# Altium schematic sheet MEHCP.SchDoc
size A4; SheetNumber: 3; SheetTotal: 6
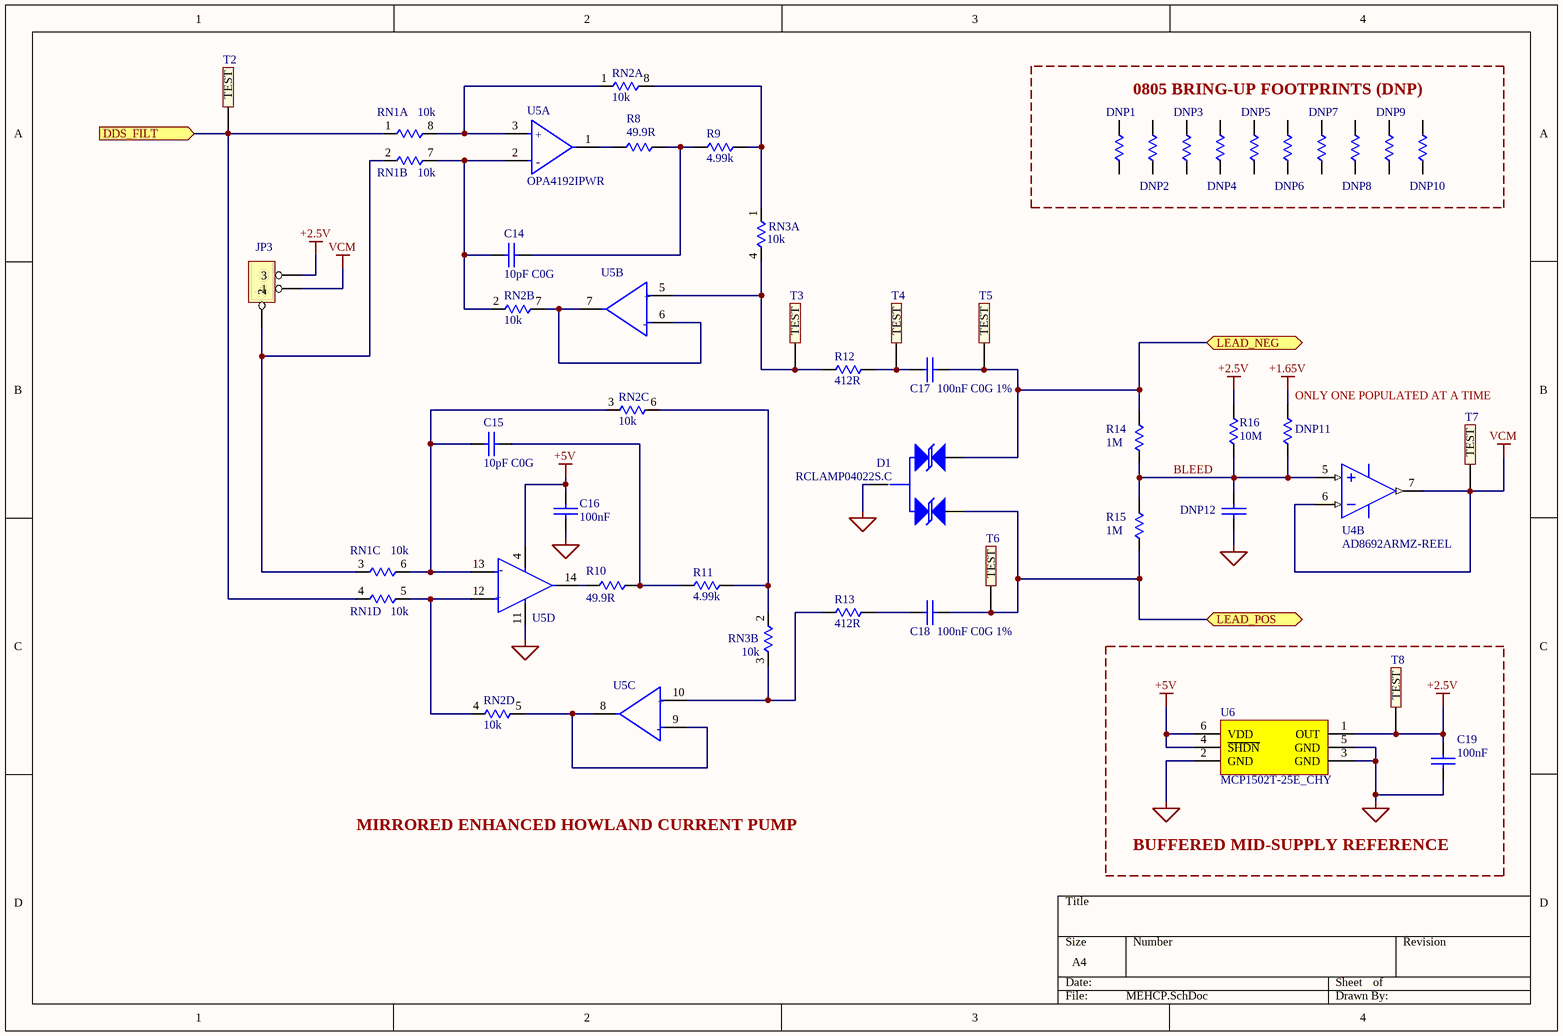
[diagram p0: MEHCP.SchDoc]

## Parts
C14  10pF C0G  [0603-CAP]
C15  10pF C0G  [0603-CAP]
C16  100nF  [0603-CAP]
C17  100nF C0G 1%  [1206-CAP]
C18  100nF C0G 1%  [1206-CAP]
C19  100nF  [0603-CAP]
D1  RCLAMP04022S.C  [SOT-23 3L]
DNP1  240R 0.1%  [0805-RES]  (value not drawn)  (no BOM)
DNP2  240R 0.1%  [0805-RES]  (value not drawn)  (no BOM)
DNP3  240R 0.1%  [0805-RES]  (value not drawn)  (no BOM)
DNP4  240R 0.1%  [0805-RES]  (value not drawn)  (no BOM)
DNP5  240R 0.1%  [0805-RES]  (value not drawn)  (no BOM)
DNP6  240R 0.1%  [0805-RES]  (value not drawn)  (no BOM)
DNP7  240R 0.1%  [0805-RES]  (value not drawn)  (no BOM)
DNP8  240R 0.1%  [0805-RES]  (value not drawn)  (no BOM)
DNP9  240R 0.1%  [0805-RES]  (value not drawn)  (no BOM)
DNP10  240R 0.1%  [0805-RES]  (value not drawn)  (no BOM)
DNP11  10M  [0603-RES]  (value not drawn)  (no BOM)
DNP12  4.7nF C0G  [0603-CAP]  (value not drawn)  (no BOM)
JP3  JUMPER1X3  [JUMPER3]  (value not drawn)
R8  49.9R  [0603-RES]
R9  4.99k  [0603-RES]
R10  49.9R  [0603-RES]
R11  4.99k  [0603-RES]
R12  412R  [0603-RES]
R13  412R  [0603-RES]
R14  1M  [0603-RES]
R15  1M  [0603-RES]
R16  10M  [0603-RES]
RN1  10k  [1206 4-Resistor Network]  (parts A,B,C,D of 4)
RN2  10k  [1206 4-Resistor Network]  (parts A,B,C,D of 4)
RN3  10k  [0606 2-RESISTOR NETWORK]  (parts A,B of 2)
T2  5002K  [TESTPOINT White]  (value not drawn)
T3  5002K  [TESTPOINT White]  (value not drawn)
T4  5002K  [TESTPOINT White]  (value not drawn)
T5  5002K  [TESTPOINT White]  (value not drawn)
T6  5002K  [TESTPOINT White]  (value not drawn)
T7  5002K  [TESTPOINT White]  (value not drawn)
T8  5002K  [TESTPOINT White]  (value not drawn)
U4  AD8692ARMZ-REEL  [ADI-RM-8_M]  (part B of 2)
U5  OPA4192IPWR  [FP-PW0014A-IPC_C]  (parts A,B,C,D of 4)
U6  MCP1502T-25E_CHY  [SOT95P280X145-6N]

## Blocks framed on the sheet
0805 BRING-UP FOOTPRINTS (DNP): DNP1-DNP10
BUFFERED MID-SUPPLY REFERENCE: C19 T8 U6

## Ports
DDS_FILT (in, see BLOCK DIAGRAM[3B], MCU[3C]), LEAD_NEG (bidir, see BLOCK DIAGRAM[3B], LOADS[1A]), LEAD_POS (bidir, see BLOCK DIAGRAM[3B], LOADS[1A])

## Nets
+1.65V: DNP11.2
+2.5V: C19.1 JP3.3 R16.2 T8.1(TEST) U6.1(OUT)
+5V: C16.1 U5.4(V+) U6.4(~{SHDN}) U6.6(VDD)
GND: C16.2 C19.2 D1.3 DNP12.1 U5.11(V-) U6.2(GND) U6.3(GND) U6.5(GND)
VCM: JP3.1 T7.1(TEST) U4.6(-IN_B) U4.7(OUT_B)
BLEED: DNP11.1 DNP12.2 R14.1 R15.2 R16.1 U4.5(+IN_B)
DDS_FILT: RN1.1 RN1.4 T2.1(TEST) ; port DDS_FILT
LEAD_NEG: C17.2 D1.2 R14.2 T5.1(TEST) ; port LEAD_NEG
LEAD_POS: C18.2 D1.1 R15.1 T6.1(TEST) ; port LEAD_POS
NetC14_1: C14.1 RN1.7 RN2.2 U5.2(-IN_A)
NetC14_2: C14.2 R8.2 R9.1
NetC15_1: C15.1 RN1.6 RN2.3 U5.13(-IN_D)
NetC15_2: C15.2 R10.2 R11.1
NetC17_1: C17.1 R12.2 T4.1(TEST)
NetC18_1: C18.1 R13.2
NetJP3_2: JP3.2 RN1.2 RN1.3
NetR8_1: R8.1 U5.1(OUT_A)
NetR9_2: R9.2 RN2.8 RN3.1
NetR10_1: R10.1 U5.14(OUT_D)
NetR11_2: R11.2 RN2.6 RN3.2
NetR12_1: R12.1 RN3.4 T3.1(TEST) U5.5(+IN_B)
NetR13_1: R13.1 RN3.3 U5.10(+IN_C)
NetRN1_5: RN1.5 RN2.4 U5.12(+IN_D)
NetRN1_8: RN1.8 RN2.1 U5.3(+IN_A)
NetRN2_5: RN2.5 U5.8(OUT_C) U5.9(-IN_C)
NetRN2_7: RN2.7 U5.6(-IN_A) U5.7(OUT_B)

Not connected (* = marked no-connect by the designer): DNP1 1 2; DNP2 1 2; DNP3 1 2; DNP4 1 2; DNP5 1 2; DNP6 1 2; DNP7 1 2; DNP8 1 2; DNP9 1 2; DNP10 1 2

## Notes on the sheet
- (near DNP11) ONLY ONE POPULATED AT A TIME
- MIRRORED ENHANCED HOWLAND CURRENT PUMP
- (in symbol CMP-04895-000439-1, part A) +; -
- (in symbol CMP-04895-000439-1, part B) +; -
- (in symbol CMP-04895-000439-1, part C) +; -
- (in symbol CMP-04895-000439-1, part D) -; +

## Library data of the parts
C14 C15 = CGA3E2C0G1H472J080AA: CAP CER 10PF 50V C0G 0603; Manufacturer Part Number 1: CC0603JRNPO9BN100; Manufacturer 1: Murata; Tech#: SMT; Detailed Description: CAP CER 10PF 50V C0G 0603; Supplier 1: DigiKey; Supplier Part Number 1: 311-1058-1-ND; Supplier 2: Mouser; Supplier Part Number 2: 810-CGA3E2C0G1H472J; Price(100): 0.1434; Price(250): 0.10756
C16 C19 = CGA3E2C0G1H472J080AA: CAP CER 100 NF 50V X7R 0603; Manufacturer Part Number 1: CC0603KRX7R9BB104; Manufacturer 1: YAGEO; Tech#: SMT; Detailed Description: CAP CER 100 NF 50V X7R 0603; Supplier 1: DigiKey; Supplier Part Number 1: 311-1344-1-ND; Supplier 2: Mouser; Supplier Part Number 2: 810-CGA3E2C0G1H472J; Price(100): 0.1434; Price(250): 0.10756
C17 C18 = GRM31C5C1H104JA01L: CAP CER 0.1UF 1% 50V C0G/NP0 1206; Manufacturer Part Number 1: GRT31C5C1H104FA02L; Manufacturer 1: Murata; Tech#: SMT; Detailed Description: CAP CER 0.1UF 1% 50V C0G/NP0 1206; Supplier 1: DigiKey; Supplier Part Number 1: 490-GRT31C5C1H104FA02LCT-ND; Supplier 2: Mouser; Supplier Part Number 2: 81-GRM31C5C1H104JA1L; Price(100): 0.2317
DNP1-DNP10 = 240R 0.1%: RES SMD 240 OHM 0.1% 1/8W 0805; Manufacturer Part Number 1: RG2012P-241-B-T5; Manufacturer 1: Susumu; Tech#: SMT; Detailed Description: RES SMD 240 OHM 0.1% 1/8W 0805; Supplier 1: Mouser; Supplier Part Number 1: 754-RG2012P-241-BT5; Supplier 2: DigiKey; Supplier Part Number 2: RG20P240BCT-ND; Price(100): 0.149
DNP11 R16 = 4.99K 0603: RES SMD 10MOHM 1% 1/10W 0603; Manufacturer Part Number 1: RC0603FR-0710ML; Manufacturer 1: YAGEO; Tech#: SMT; Detailed Description: RES SMD 10MOHM 1% 1/10W 0603; Supplier 1: DigiKey; Supplier Part Number 1: 311-10.0MHRCT-ND; Supplier 2: Mouser; Supplier Part Number 2: 754-RR0816P-4991D68H; Price(100): 0.023
DNP12 = CGA3E2C0G1H472J080AA: CAP CER 4700PF 50V C0G 0603; Manufacturer Part Number 1: GRM1885C1H472JA01D; Manufacturer 1: Murata; Tech#: SMT; Detailed Description: CAP CER 4700PF 50V C0G 0603; Supplier 1: DigiKey; Supplier Part Number 1: 490-9669-1-ND; Supplier 2: Mouser; Supplier Part Number 2: 810-CGA3E2C0G1H472J; Price(100): 0.1434; Price(250): 0.10756
JP3 = 68001-203HLF: CONN HEADER VERT 36POS 2.54MM; Manufacturer 1: FCI; Detailed Description: Jumper, 1x3 Vertical T/H 0.1in; Location: #N/A; Notes: Can be 68001-236HLF cut to length; Tech#: T/H; Manufacturer Part Number 1: 68001-203HLF; Supplier 1: DigiKey; Supplier Part Number 1: 609-3470-ND; Supplier 2: Mouser; Supplier Part Number 2: 649-68001-203HLF; Price(1): 0.43; Price(10): 0.32; Price(25): 0.32; Price(100): 0.2436
R8 R10 = 4.99K 0603: RES SMD 49.9OHM 0.1% 1/10W 0603; Manufacturer Part Number 1: RT0603BRD0749R9L; Manufacturer 1: Yageo; Tech#: SMT; Detailed Description: RES SMD 49.9OHM 0.1% 1/10W 0603; Supplier 1: DigiKey; Supplier Part Number 1: YAG1672CT-ND; Supplier 2: Mouser; Supplier Part Number 2: 754-RR0816P-4991D68H; Price(100): 0.023
R9 R11 = 4.99K 0603: RES SMD 4.99KOHM 0.1% 1/10W 0603; Manufacturer Part Number 1: RG1608P-4991-B-T5; Manufacturer 1: Susumu; Tech#: SMT; Detailed Description: RES SMD 4.99KOHM 0.1% 1/10W 0603; Supplier 1: DigiKey; Supplier Part Number 1: RG16P4.99KBCT-ND; Supplier 2: Mouser; Supplier Part Number 2: 754-RR0816P-4991D68H; Price(100): 0.023
R12 R13 = 4.99K 0603: RES SMD 412OHM 0.1% 1/10W 0603; Manufacturer Part Number 1: RT0603BRD07412RL; Manufacturer 1: YAGEO; Tech#: SMT; Detailed Description: RES SMD 412OHM 0.1% 1/10W 0603; Supplier 1: DigiKey; Supplier Part Number 1: YAG1659CT-ND; Supplier 2: Mouser; Supplier Part Number 2: 754-RR0816P-4991D68H; Price(100): 0.023
R14 R15 = 4.99K 0603: RES SMD 1MOHM 0.1% 1/10W 0603; Manufacturer Part Number 1: RT0603BRD071ML; Manufacturer 1: YAGEO; Detailed Description: RES SMD 1OHM 0.1% 1/10W 0603; Tech#: SMT; Supplier 1: DigiKey; Supplier Part Number 1: YAG4498CT-ND; Supplier 2: Mouser; Supplier Part Number 2: 754-RR0816P-4991D68H; Price(100): 0.023
RN1 RN2 = ACASA1002S1002P1AT: 4 resistor, resistor network in a 8 pin DIP package
RN3 = ACASN1002S1002P1AT: 2 resistor, resistor network, 10k/10k 0.1% abs. and 0.05% rel., 0606, 25ppm
T2-T8 = 5002K: PC TEST POINT MINIATURE WHITE; Manufacturer 1: Keystone Electronics; Detailed Description: Connector, TestPoint White; Location: F1-33; Tech#: T/H; Manufacturer Part Number 1: 5002K; Supplier 1: DigiKey; Supplier Part Number 1: 36-5002-ND; Supplier 2: Mouser; Supplier Part Number 2: 534-5002; Price(1): 0.56; Price(10): 0.506; Price(100): 0.3541
U4 = CMP-0384-01747-1: Double Channel Wide Bandwidth Operational Amplifier, 10 MHz BW, 5 V/us SR, Industrial, 8-pin SOP (RM-8), Reel; Manufacturer: Analog Devices; Generic Part Number: AD8692; Slew Rate: 5V/us; Automotive Qualified: Yes; V Span Max: 6V; V Span Min: 2.7V; Input Bias Current: 200fA; Amplifiers Per Package: 2; Iq/Amp: 1.05mA; Input Offset Voltage: 400uV; Small Signal Bandwidth: 10MHz; ComponentLink1Description: Manufacturer URL; ComponentLink1URL: http://www.analog.com/en/index.html; Mounting Technology: Surface Mount; PackageDescription: 8-Pin Mini Small Outline Package, Body 3 x 3 mm, Pitch 0.65 mm; PackageReference: RM-8; DatasheetVersion: Rev. E; PartNumber: AD8692ARMZ-REEL; ComponentLink2Description: Datasheet; ComponentLink3Description: Package Specification; ComponentLink2URL: http://www.analog.com/static/imported-files/data_sheets/AD8691_8692_8694.pdf; ComponentLink3URL: http://www.analog.com/static/imported-files/packages/PKG_PDF/MSOP%28RM%29/RM_8.pdf; Code_JEDEC: MO-187-AA
U5 = CMP-04895-000439-1: IC OPAMP GP 4 CIRCUIT 14TSSOP; Gain Bandwidth Product: 10MHz; Number of Channels: 4; Case/Package: TSSOP; Lead Free: Lead Free; Max Operating Temperature: 125°C; RoHS Compliant: Yes; Min Operating Temperature: -40°C
U6 = MCP1502T-25E_CHY: Series Voltage Reference IC Fixed 2.5V V +/-0.1% 20 mA SOT-23-6; Manufacturer_Name: Microchip; Manufacturer_Part_Number: MCP1502T-25E/CHY; Geometry.Height: 1.45mm; Mouser Part Number: 579-MCP1502T-25E/CHY; Mouser Price/Stock: https://www.mouser.co.uk/ProductDetail/Microchip-Technology/MCP1502T-25E-CHY?qs=W%2FMpXkg%252BdQ4EOhKykk%2F7dw%3D%3D; Datasheet Link: *